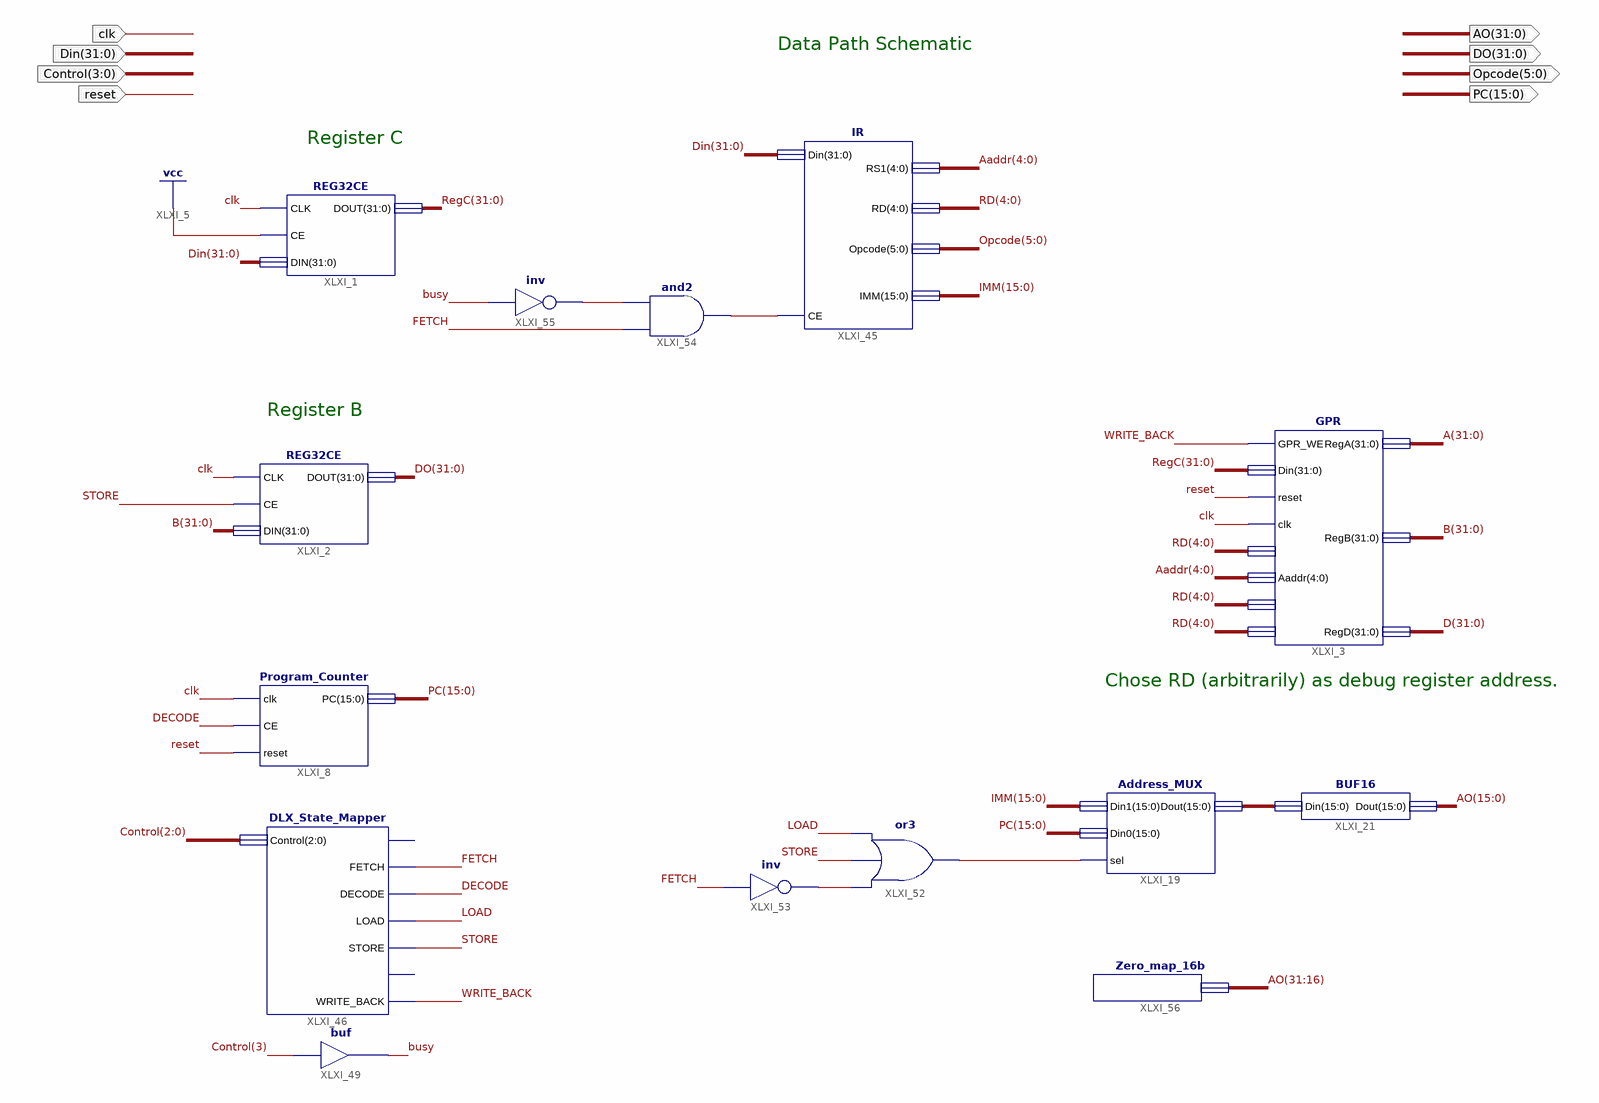
[diagram p0: schematic sheet 1]
// Xilinx ISE schematic Data_Path.sch (spartan6) as structural Verilog: 14 symbols, 8 ports
module Data_Path (
  input  clk,
  input  [31:0] Din,
  input  reset,
  input  [3:0] Control,
  output [31:0] AO,
  output [31:0] DO,
  output [5:0] Opcode,
  output [15:0] PC
);

  wire busy, DECODE, FETCH, LOAD, STORE, WRITE_BACK, XLXN_192, XLXN_195, XLXN_197, XLXN_198;
  wire [4:0] Aaddr, RD;
  wire [15:0] IMM, XLXN_89;
  wire [31:0] A, B, D, RegC;

  REG32CE XLXI_1 (.CLK(clk), .CE(1'b1), .DIN(Din), .DOUT(RegC));
  Address_MUX XLXI_19 (.Din1(IMM), .Din0(PC), .sel(XLXN_192), .Dout(XLXN_89));
  BUF16 XLXI_21 (.Din(XLXN_89), .Dout(AO[15:0]));
  REG32CE XLXI_2 (.CLK(clk), .CE(STORE), .DIN(B), .DOUT(DO));
  GPR XLXI_3 (
    .GPR_WE(WRITE_BACK), .Din(RegC), .reset(reset), .clk(clk), .Caddr(RD), .Aaddr(Aaddr), .Baddr(RD),
    .Daddr(RD), .RegA(A), .RegB(B), .RegD(D));
  Program_Counter XLXI_8 (.clk(clk), .CE(DECODE), .reset(reset), .PC(PC));
  IR XLXI_45 (.Din(Din), .CE(XLXN_197), .RS1(Aaddr), .RD(RD), .Opcode(Opcode), .IMM(IMM));
  DLX_State_Mapper XLXI_46 (
    .Control(Control[2:0]), .FETCH(FETCH), .DECODE(DECODE), .LOAD(LOAD), .STORE(STORE),
    .WRITE_BACK(WRITE_BACK));  // open: INIT, HALT
  buf XLXI_49 (busy, Control[3]);
  or XLXI_52 (XLXN_192, XLXN_195, STORE, LOAD);
  not XLXI_53 (XLXN_195, FETCH);
  and XLXI_54 (XLXN_197, FETCH, XLXN_198);
  not XLXI_55 (XLXN_198, busy);
  Zero_map_16b XLXI_56 (.Dout(AO[31:16]));

  // Notes on the sheet:
  //   Data Path Schematic
  //   Register C
  //   Register B
  //   Chose RD (arbitrarily) as debug register address.
endmodule
